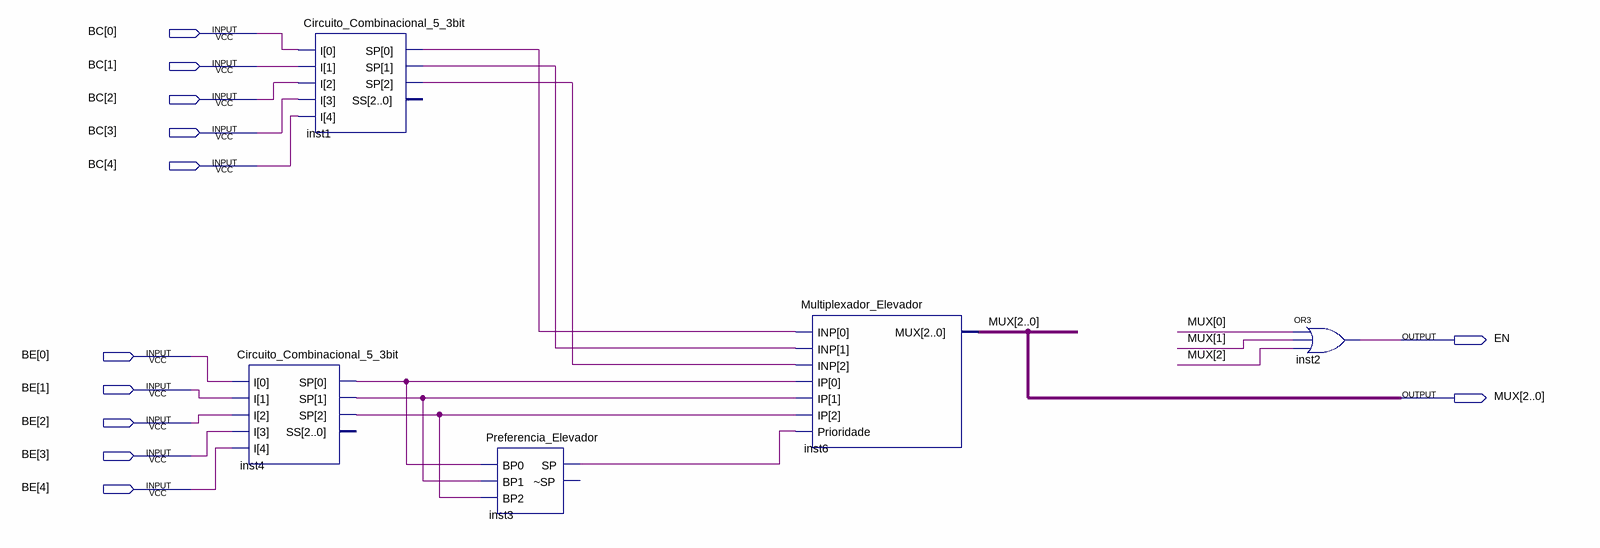
[diagram p0: schematic sheet]
// Quartus schematic Controlador_PrioridadeV2.bdf as structural Verilog: 5 symbols, 12 pins
module Controlador_PrioridadeV2 (
  input  [4:0] BC,
  input  [4:0] BE,
  output EN,
  output [2:0] MUX
);

  wire inst1_sp, inst1_sp_2, inst1_sp_3, inst3_sp, inst4_sp, inst4_sp_2, inst4_sp_3;

  Circuito_Combinacional_5_3bit inst4 (.I(BE), .SP({inst4_sp_3, inst4_sp_2, inst4_sp}));  // open: SS
  Circuito_Combinacional_5_3bit inst1 (.I(BC), .SP({inst1_sp_3, inst1_sp_2, inst1_sp}));  // open: SS
  Preferencia_Elevador inst3 (.BP0(inst4_sp), .BP1(inst4_sp_2), .BP2(inst4_sp_3), .SP(inst3_sp));  // open: ~SP
  Multiplexador_Elevador inst6 (
    .INP({inst1_sp_3, inst1_sp_2, inst1_sp}), .IP({inst4_sp_3, inst4_sp_2, inst4_sp}), .Prioridade(inst3_sp),
    .MUX(MUX));
  or inst2 (EN, MUX[0], MUX[1], MUX[2]);
endmodule
